# Altium schematic sheet Sheet1.SchDoc
size A4; SheetNumber: 1; SheetTotal: 1
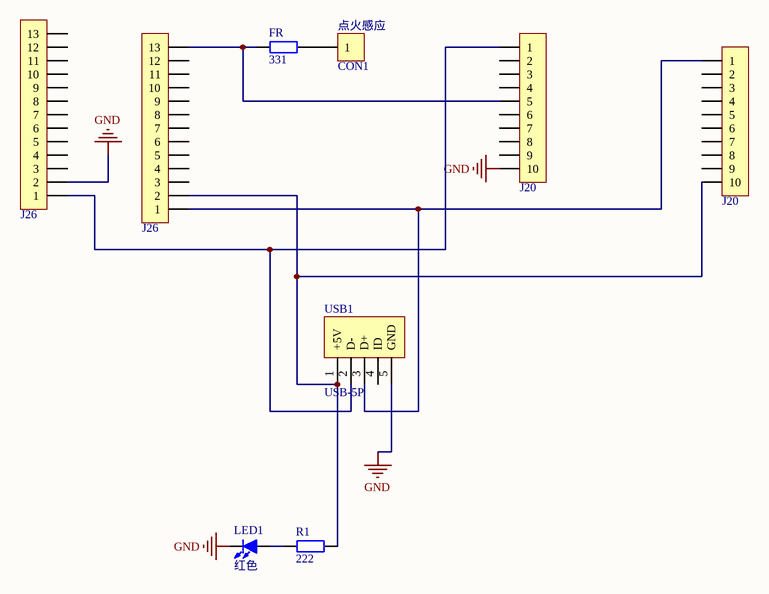
[diagram p0: Sheet1.SchDoc]

## Parts
(Parts that share a designator on the sheet are numbered #1, #2 ... from top to bottom, then left to right.)
FR  331  [R 0603_L]
J20#1  HDR-1X10  [10P空PCB图画摩托罗拉写频板用]  (value not drawn)
J20#2  HDR-1X10  [10P空PCB图画摩托罗拉写频板用]  (value not drawn)
J26#1  HDR-1X13  [13针PCB空]  (value not drawn)
J26#2  HDR-1X13  [13针PCB空]  (value not drawn)
LED1  红色  [LED 0603R]
R1  222  [R 0603_L]
USB1  USB-5P  [USB-MICRO_A]
点火感应  CON1  [SIP1-FANGPAN]

## Nets
GND: J20#1.10 J26#1.2 LED1.2(K) USB1.5(GND)
NetFR_1: FR.1 J20#1.5 J26#2.13
NetFR_2: FR.2 点火感应.1
NetJ20#1_1: J20#1.1 J26#1.1 USB1.2(D-)
NetJ20#2_1: J20#2.1 J26#2.1 USB1.3(D+)
NetJ20#2_10: J20#2.10 J26#2.2 R1.2 USB1.1(+5V)
NetLED1_1: LED1.1(A) R1.1

Not connected (* = marked no-connect by the designer): J20#1 2 3 4 6 7 8 9; J20#2 2 3 4 5 6 7 8 9; J26#1 3 4 5 6 7 8 9 10 11 12 13; J26#2 3 4 5 6 7 8 9 10 11 12; USB1 4(ID)

## Library data of the parts
FR R1 = R: 贴片电阻; 版权归属: 来自淘宝 ID：黄晶宝石; 封装库来自淘宝卖家 ID：黄晶宝石: 其他店铺购入均为盗版，不享受售后技术支持服务，请立即申请退款; BOM名称: 贴片电阻; 联系售后: https://shop463601444.taobao.com
J20#1 J20#2 = Header 10: 10P接插件; 版权归属: 淘宝ID:黄晶宝石; BOM名称: 10P接插件; 学习资源: https://shop463601444.taobao.com
J26#1 J26#2 = Header 13: 13P接插件; 版权归属: 封装库来自淘宝卖家 ID：黄晶宝石; BOM名称: 13P接插件; 学习资源: https://shop463601444.taobao.com
LED1 = LED-SMD: 贴片LED; 版权归属: 封装库来自淘宝 ID：黄晶宝石; BOM名称: 贴片LED; 学习资源: https://shop463601444.taobao.com
USB1 = USB-5P: 微型USB母座; BOM名称: 微型USB母座; 学习资源: https://shop463601444.taobao.com